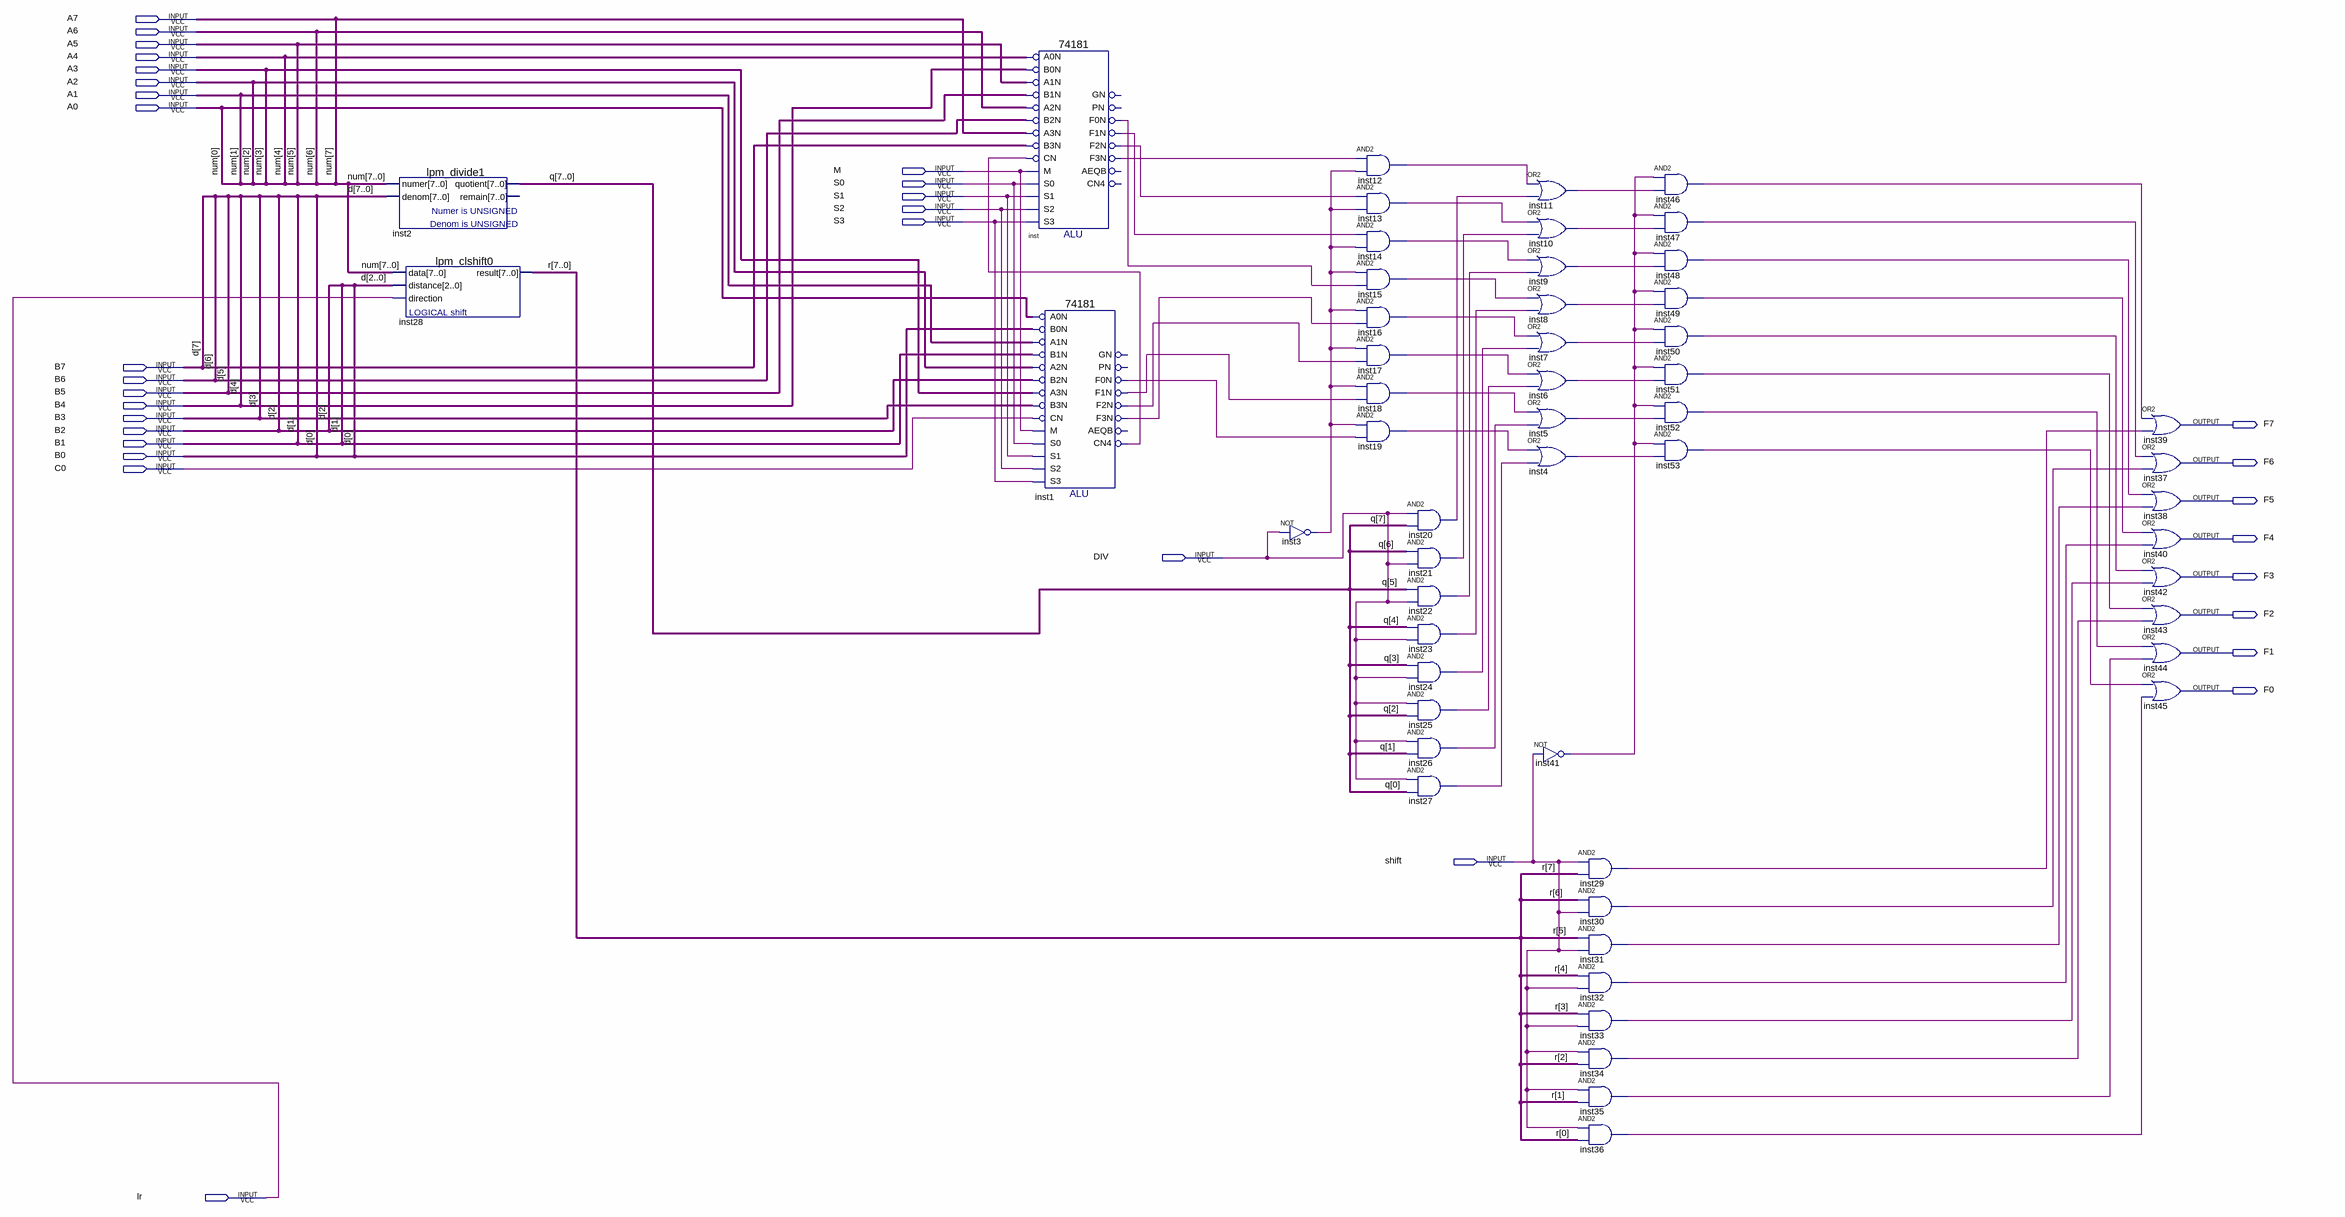
[diagram p0: schematic sheet]
// Quartus schematic ALU.bdf as structural Verilog: 54 symbols, 33 pins
module ALU (
  input  A7,
  input  A6,
  input  A5,
  input  A4,
  input  A3,
  input  A2,
  input  A1,
  input  A0,
  input  M,
  input  S0,
  input  S1,
  input  S2,
  input  S3,
  input  B7,
  input  B6,
  input  B5,
  input  B4,
  input  B3,
  input  B2,
  input  B1,
  input  B0,
  input  C0,
  input  DIV,
  input  shift,
  input  lr,
  output F7,
  output F6,
  output F5,
  output F4,
  output F3,
  output F2,
  output F1,
  output F0
);

  wire inst1_cn4, inst1_f0n, inst1_f1n, inst1_f2n, inst1_f3n, inst3_out, inst4_out, inst5_out, inst6_out,
       inst7_out, inst8_out, inst9_out, inst10_out, inst11_out, inst12_out, inst13_out, inst14_out,
       inst15_out, inst16_out, inst17_out, inst18_out, inst19_out, inst20_out, inst21_out, inst22_out,
       inst23_out, inst24_out, inst25_out, inst26_out, inst27_out, inst29_out, inst30_out, inst31_out,
       inst32_out, inst33_out, inst34_out, inst35_out, inst36_out, inst41_out, inst46_out, inst47_out,
       inst48_out, inst49_out, inst50_out, inst51_out, inst52_out, inst53_out, inst_f0n, inst_f1n, inst_f2n,
       inst_f3n;
  wire [7:0] q, r;

  lpm_divide1 inst2 (
    .numer({A7, A6, A5, A4, A3, A2, A1, A0}), .denom({B7, B6, B5, B4, B3, B2, B1, B0}), .quotient(q));  // open: remain
  lpm_clshift0 inst28 (.data({A7, A6, A5, A4, A3, A2, A1, A0}), .distance({B2, B1, B0}), .direction(lr), .result(r));
  \74181  inst (
    .B0N(B4), .A0N(A4), .A1N(A5), .B1N(B5), .A3N(A7), .B2N(B6), .A2N(A6), .M(M), .CN(inst1_cn4), .B3N(B7),
    .S2(S2), .S1(S1), .S0(S0), .S3(S3), .F3N(inst_f3n), .F1N(inst_f1n), .F0N(inst_f0n), .F2N(inst_f2n));  // open: PN, GN, AEQB, CN4
  \74181  inst1 (
    .B0N(B0), .A0N(A0), .A1N(A1), .B1N(B1), .A3N(A3), .B2N(B2), .A2N(A2), .M(M), .CN(C0), .B3N(B3), .S2(S2),
    .S1(S1), .S0(S0), .S3(S3), .F3N(inst1_f3n), .F1N(inst1_f1n), .F0N(inst1_f0n), .CN4(inst1_cn4),
    .F2N(inst1_f2n));  // open: PN, GN, AEQB
  not inst3 (inst3_out, DIV);
  and inst12 (inst12_out, inst_f3n, inst3_out);
  and inst13 (inst13_out, inst_f2n, inst3_out);
  and inst14 (inst14_out, inst_f1n, inst3_out);
  and inst15 (inst15_out, inst3_out, inst_f0n);
  and inst16 (inst16_out, inst3_out, inst1_f3n);
  and inst17 (inst17_out, inst3_out, inst1_f2n);
  and inst18 (inst18_out, inst3_out, inst1_f1n);
  and inst19 (inst19_out, inst3_out, inst1_f0n);
  and inst20 (inst20_out, DIV, q[7]);
  and inst21 (inst21_out, q[6], DIV);
  and inst22 (inst22_out, q[5], DIV);
  and inst23 (inst23_out, q[4], DIV);
  and inst24 (inst24_out, q[3], DIV);
  and inst25 (inst25_out, DIV, q[2]);
  and inst26 (inst26_out, DIV, q[1]);
  and inst27 (inst27_out, DIV, q[0]);
  or inst11 (inst11_out, inst12_out, inst20_out);
  or inst10 (inst10_out, inst13_out, inst21_out);
  or inst9 (inst9_out, inst14_out, inst22_out);
  or inst8 (inst8_out, inst15_out, inst23_out);
  or inst7 (inst7_out, inst16_out, inst24_out);
  or inst6 (inst6_out, inst17_out, inst25_out);
  or inst5 (inst5_out, inst18_out, inst26_out);
  or inst4 (inst4_out, inst19_out, inst27_out);
  not inst41 (inst41_out, shift);
  and inst29 (inst29_out, shift, r[7]);
  and inst30 (inst30_out, r[6], shift);
  and inst31 (inst31_out, r[5], shift);
  and inst32 (inst32_out, r[4], shift);
  and inst33 (inst33_out, r[3], shift);
  and inst34 (inst34_out, shift, r[2]);
  and inst35 (inst35_out, shift, r[1]);
  and inst36 (inst36_out, shift, r[0]);
  and inst46 (inst46_out, inst41_out, inst11_out);
  and inst47 (inst47_out, inst41_out, inst10_out);
  and inst48 (inst48_out, inst41_out, inst9_out);
  and inst49 (inst49_out, inst41_out, inst8_out);
  and inst50 (inst50_out, inst41_out, inst7_out);
  and inst51 (inst51_out, inst41_out, inst6_out);
  and inst52 (inst52_out, inst41_out, inst5_out);
  and inst53 (inst53_out, inst41_out, inst4_out);
  or inst39 (F7, inst46_out, inst29_out);
  or inst37 (F6, inst47_out, inst30_out);
  or inst38 (F5, inst48_out, inst31_out);
  or inst40 (F4, inst49_out, inst32_out);
  or inst42 (F3, inst50_out, inst33_out);
  or inst43 (F2, inst51_out, inst34_out);
  or inst44 (F1, inst52_out, inst35_out);
  or inst45 (F0, inst53_out, inst36_out);

  // Other names for the same wires on the sheet: d[7:0] = {B7, B6, B5, B4, B3, B2, B1, B0};
  //   num[7:0] = {A7, A6, A5, A4, A3, A2, A1, A0}
endmodule
